# Altium schematic sheet Debugger.SchDoc
size B; Author: E. Sims; Organization: Let's Build Rockets Inc.; SheetNumber: 10; SheetTotal: 10
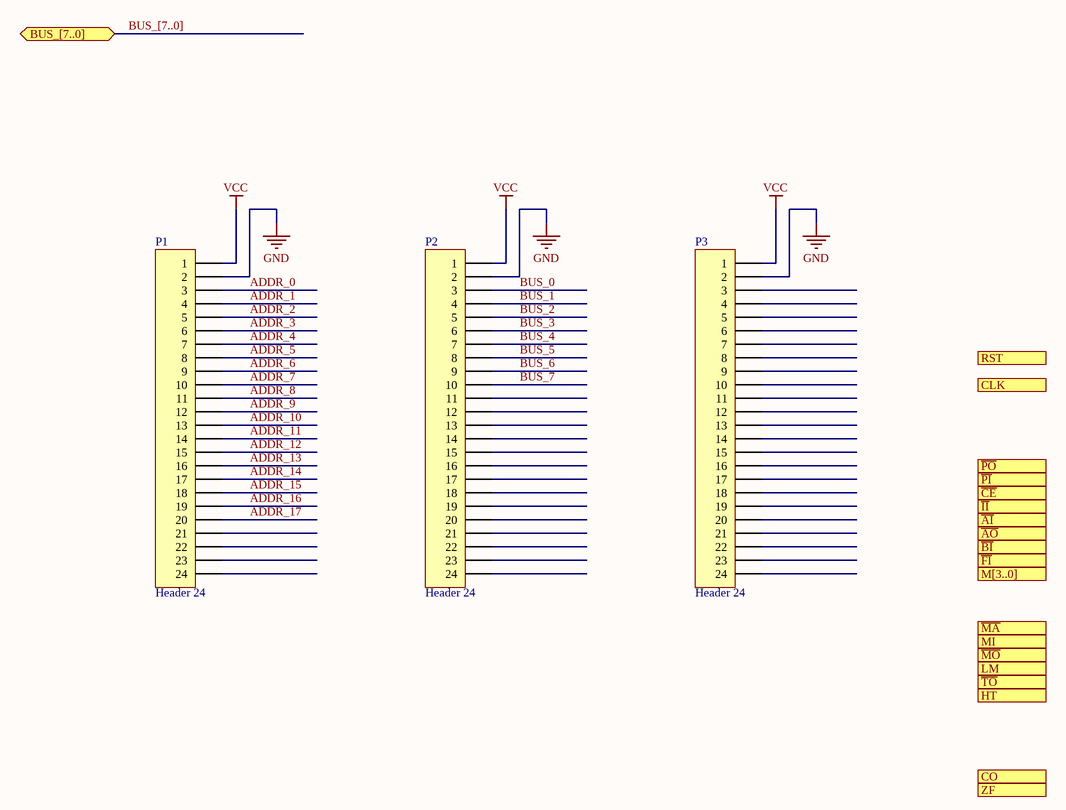
[diagram p0: Debugger.SchDoc]

## Parts
P1  Header 24  [HDR1X24]
P2  Header 24  [HDR1X24]
P3  Header 24  [HDR1X24]

## Ports
BUS_[7..0] (bidir), CLK (in), CO (in), HT (out), LM (out), M[3..0] (out), MI (out), RST (in), ZF (in), ~{AI} (out), ~{AO} (out), ~{BI} (out), ~{CE} (out), ~{FI} (out), ~{II} (out), ~{MA} (out), ~{MO} (out), ~{PI} (out), ~{PO} (out), ~{TO} (out)

## Nets
GND: P1.2 P2.2 P3.2
VCC: P1.1 P2.1 P3.1
ADDR_0: P1.3
ADDR_1: P1.4
ADDR_2: P1.5
ADDR_3: P1.6
ADDR_4: P1.7
ADDR_5: P1.8
ADDR_6: P1.9
ADDR_7: P1.10
ADDR_8: P1.11
ADDR_9: P1.12
ADDR_10: P1.13
ADDR_11: P1.14
ADDR_12: P1.15
ADDR_13: P1.16
ADDR_14: P1.17
ADDR_15: P1.18
ADDR_16: P1.19
ADDR_17: P1.20
BUS_0: P2.3
BUS_1: P2.4
BUS_2: P2.5
BUS_3: P2.6
BUS_4: P2.7
BUS_5: P2.8
BUS_6: P2.9
BUS_7: P2.10

Not connected (* = marked no-connect by the designer): P1 21 22 23 24; P2 11 12 13 14 15 16 17 18 19 20 21 22 23 24; P3 3 4 5 6 7 8 9 10 11 12 13 14 15 16 17 18 19 20 21 22 23 24

## Buses and harness runs
bus BUS_[7..0] = port BUS_[7..0]

## Notes on the sheet
- Let's Build Rocket's Inc. Modular Paylaod System Based on TMP-010 Rev
  For more information visit https://github.com/LetsBuildRockets/Modular-Payload-System
  This work is licensed under CC BY-NC 4.0. To view a copy of this license, visit https://creativecommons.org/licenses/by-nc/4.0
- Title
- Size:
- Date:
- Assembly Variant:
- B
- Number:
- Time:
- Revision:
- Sheet
- of
- Author:
- File:

## Library data of the parts
P1-P3 = Header 24: Header, 24-Pin; LatestRevisionDate: 17-Jul-2002; LatestRevisionNote: Re-released for DXP Platform.; Publisher: Altium Limited